# EAGLE design Backplane_extRefV4 (EAGLE 6.6.0)
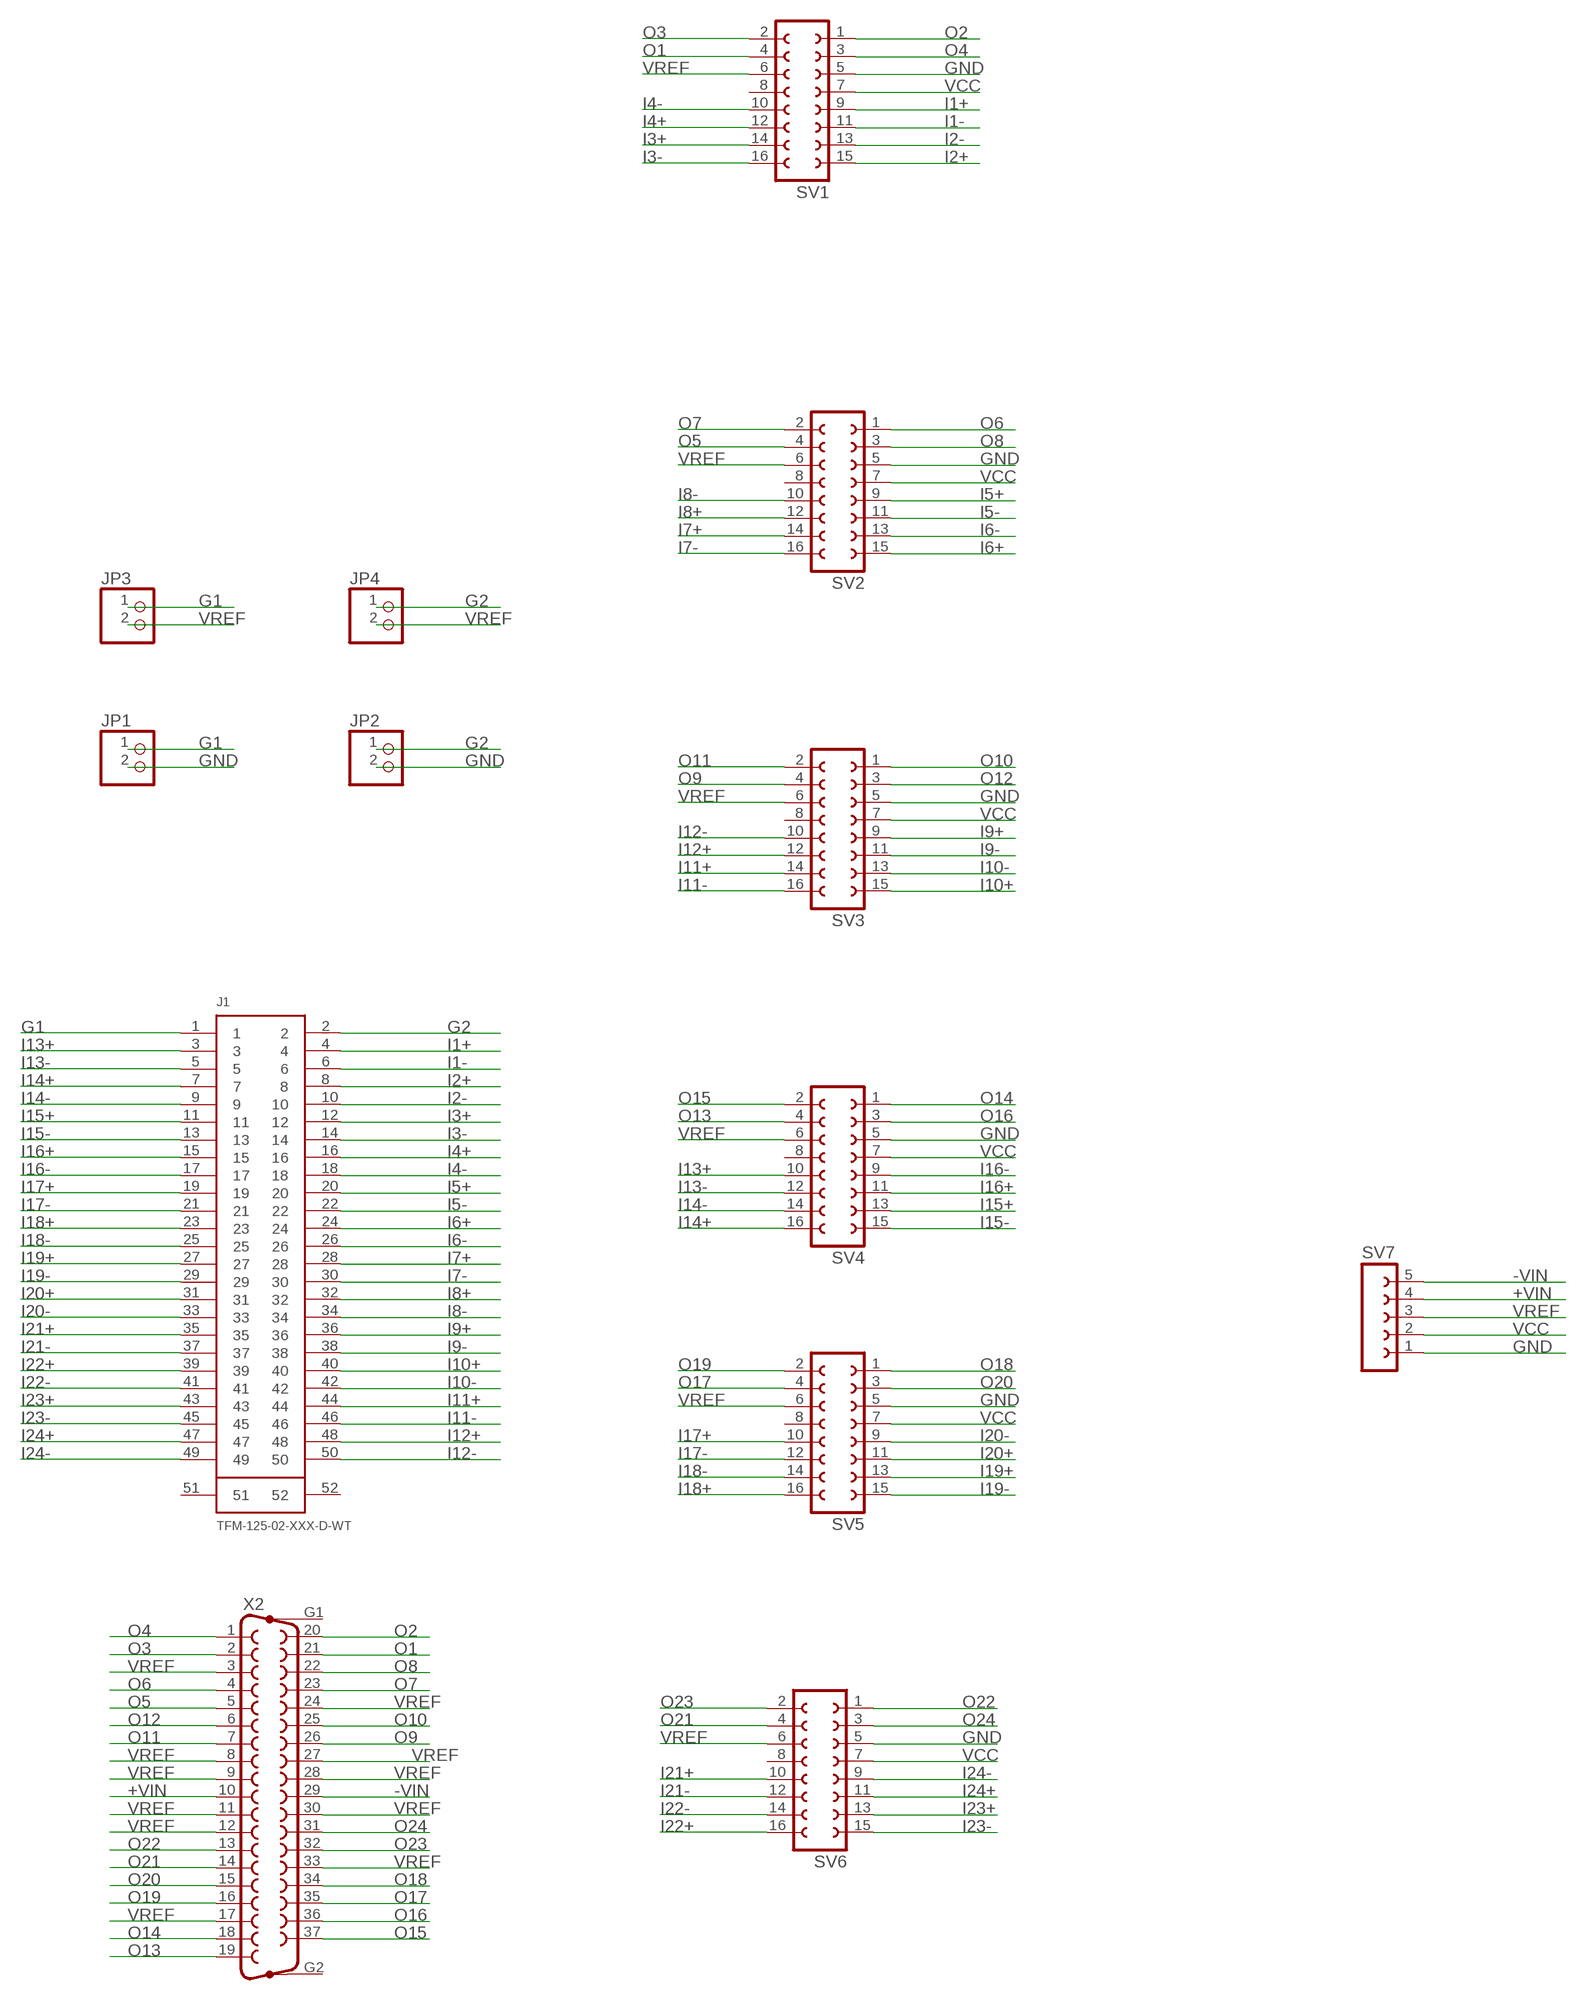
[diagram p0: schematic, sheet 1]

## Parts
J1  TFM-125-02-XXX-D-WT  [TFM-125-02-XXX-D-WT]
JP1  PINHD-1X2  [1X02]
JP2  PINHD-1X2  [1X02]
JP3  PINHD-1X2  [1X02]
JP4  PINHD-1X2  [1X02]
SV1  FE08-2  [FE08-2]
SV2  FE08-2  [FE08-2]
SV3  FE08-2  [FE08-2]
SV4  FE08-2  [FE08-2]
SV5  FE08-2  [FE08-2]
SV6  FE08-2  [FE08-2]
SV7  FE05-1  [FE05-1]
X2  F37HP  [F37HP]

## Nets
+VIN: SV7.4 X2.10
-VIN: SV7.5 X2.29
G1: J1.1 JP1.1 JP3.1
G2: J1.2 JP2.1 JP4.1
GND: JP1.2 JP2.2 SV1.5 SV2.5 SV3.5 SV4.5 SV5.5 SV6.5 SV7.1
I1+: J1.4 SV1.9
I1-: J1.6 SV1.11
I2+: J1.8 SV1.15
I2-: J1.10 SV1.13
I3+: J1.12 SV1.14
I3-: J1.14 SV1.16
I4+: J1.16 SV1.12
I4-: J1.18 SV1.10
I5+: J1.20 SV2.9
I5-: J1.22 SV2.11
I6+: J1.24 SV2.15
I6-: J1.26 SV2.13
I7+: J1.28 SV2.14
I7-: J1.30 SV2.16
I8+: J1.32 SV2.12
I8-: J1.34 SV2.10
I9+: J1.36 SV3.9
I9-: J1.38 SV3.11
I10+: J1.40 SV3.15
I10-: J1.42 SV3.13
I11+: J1.44 SV3.14
I11-: J1.46 SV3.16
I12+: J1.48 SV3.12
I12-: J1.50 SV3.10
I13+: J1.3 SV4.10
I13-: J1.5 SV4.12
I14+: J1.7 SV4.16
I14-: J1.9 SV4.14
I15+: J1.11 SV4.13
I15-: J1.13 SV4.15
I16+: J1.15 SV4.11
I16-: J1.17 SV4.9
I17+: J1.19 SV5.10
I17-: J1.21 SV5.12
I18+: J1.23 SV5.16
I18-: J1.25 SV5.14
I19+: J1.27 SV5.13
I19-: J1.29 SV5.15
I20+: J1.31 SV5.11
I20-: J1.33 SV5.9
I21+: J1.35 SV6.10
I21-: J1.37 SV6.12
I22+: J1.39 SV6.16
I22-: J1.41 SV6.14
I23+: J1.43 SV6.13
I23-: J1.45 SV6.15
I24+: J1.47 SV6.11
I24-: J1.49 SV6.9
O1: SV1.4 X2.21
O2: SV1.1 X2.20
O3: SV1.2 X2.2
O4: SV1.3 X2.1
O5: SV2.4 X2.5
O6: SV2.1 X2.4
O7: SV2.2 X2.23
O8: SV2.3 X2.22
O9: SV3.4 X2.26
O10: SV3.1 X2.25
O11: SV3.2 X2.7
O12: SV3.3 X2.6
O13: SV4.4 X2.19
O14: SV4.1 X2.18
O15: SV4.2 X2.37
O16: SV4.3 X2.36
O17: SV5.4 X2.35
O18: SV5.1 X2.34
O19: SV5.2 X2.16
O20: SV5.3 X2.15
O21: SV6.4 X2.14
O22: SV6.1 X2.13
O23: SV6.2 X2.32
O24: SV6.3 X2.31
VCC: SV1.7 SV2.7 SV3.7 SV4.7 SV5.7 SV6.7 SV7.2
VREF: JP3.2 JP4.2 SV1.6 SV2.6 SV3.6 SV4.6 SV5.6 SV6.6 SV7.3 X2.3 X2.8 X2.9 X2.11 X2.12 X2.17 X2.24 X2.27 X2.28 X2.30 X2.33
Unconnected: J1.51 J1.52 SV1.8 SV2.8 SV3.8 SV4.8 SV5.8 SV6.8 X2.G1 X2.G2

## Library data of the parts
J1 = TFM-125-02-XXX-D-WT:TFM-125-02-XXX-D-WT: 0.050"X0.050" SURFACE MOUNT TERMINAL STRIP WITH DUAL WELD TAB.
JP1-JP4 = pinhead:PINHD-1X2: PIN HEADER
SV1-SV6 = con-lsta:FE08-2: FEMALE HEADER; OC_FARNELL: unknown; OC_NEWARK: unknown
SV7 = con-lsta:FE05-1: FEMALE HEADER; OC_FARNELL: unknown; OC_NEWARK: unknown
X2 = con-subd:F37HP: SUB-D; OC_FARNELL: unknown; OC_NEWARK: unknown

## Board
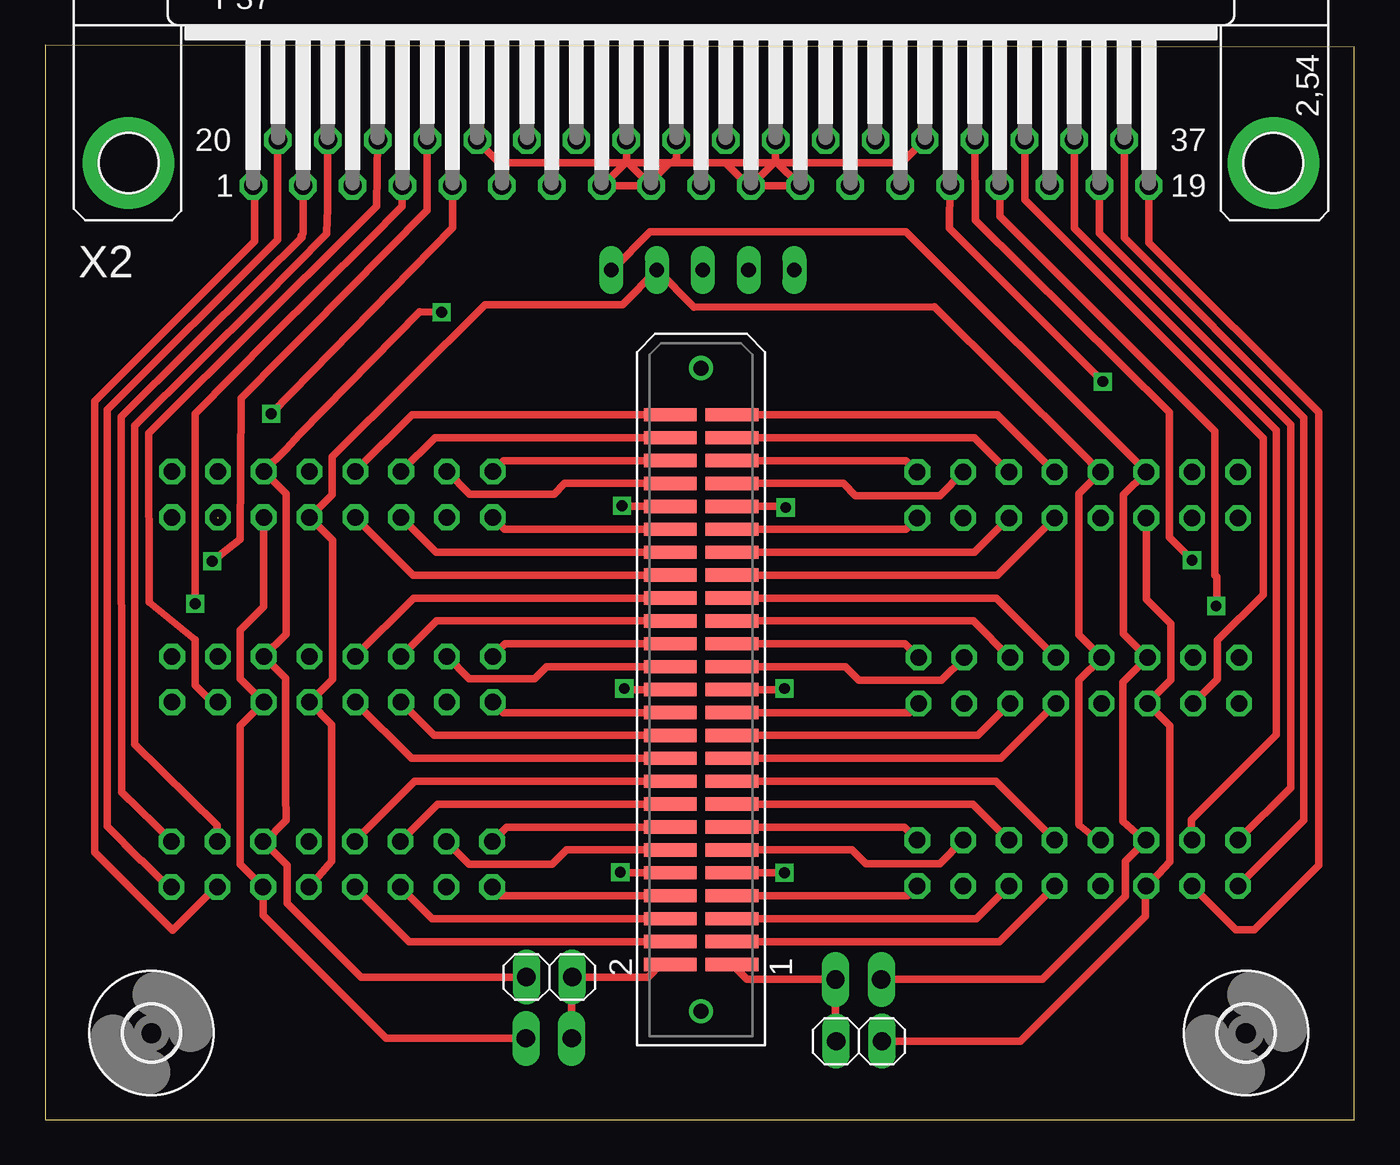
[diagram p1: board, top side]
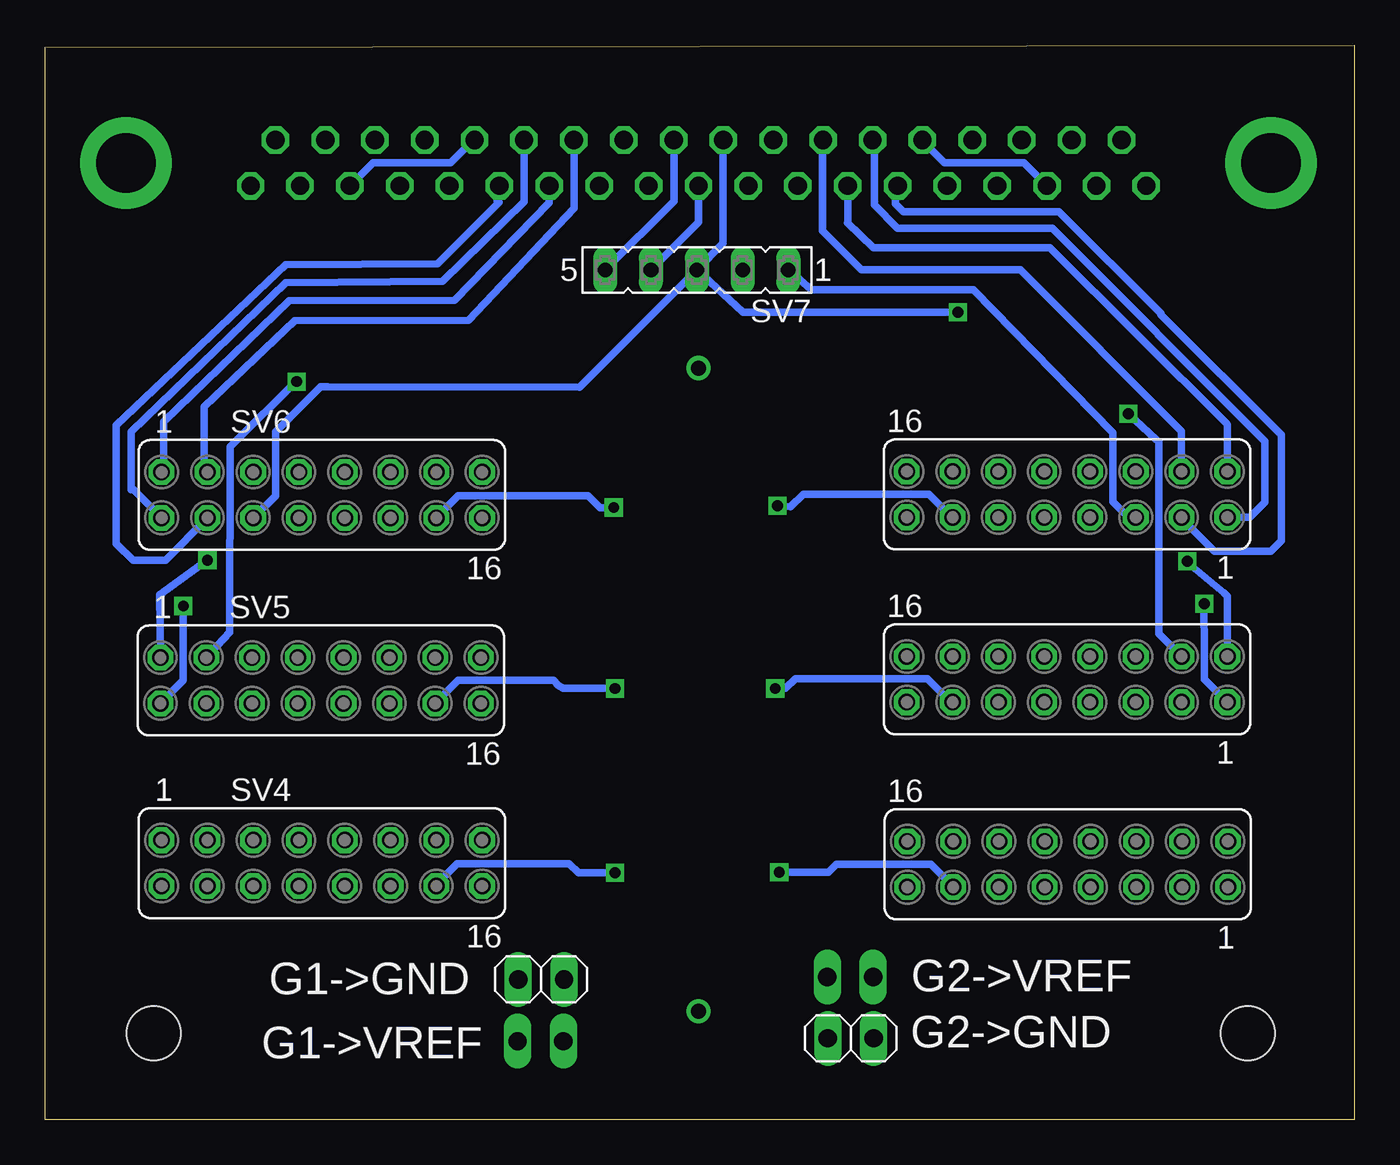
[diagram p2: board, bottom side, seen from below]

Size 72.63 x 59.58 mm. Coordinates in mm from the lower left corner, seen from the top.
Outline: 0,0 72.63,0 72.63,59.46 0,59.59 0,0
Copper layers (1*16): Top 0.035mm / dielectric 1.5mm / Bottom 0.035mm
Design rules "default *": minimum track width 10mil, minimum drill 10mil, track to track 8mil, track to pad 8mil, pad to pad 8mil, via to via 8mil, smd to smd 8mil, copper to edge 40mil, drill to drill 8mil, minimum pad ring 10mil, minimum via ring 8mil, stop-mask expansion 4mil, vias tented up to drill 0mil, thermal gap 10mil

### Footprints (pad centres in the part's own frame; a part is rotated, then mirrored left to right if it is on the bottom)
TFM-125-02-XXX-D-WT = smd 0.737 x 2.921: 1 -15.24,-1.714; 2 -15.24,1.714; 3 -13.97,-1.714; 4 -13.97,1.714; 5 -12.7,-1.714; 6 -12.7,1.714; 7 -11.43,-1.714; 8 -11.43,1.714; 9 -10.16,-1.714; 10 -10.16,1.714; 11 -8.89,-1.714; 12 -8.89,1.714; 13 -7.62,-1.714; 14 -7.62,1.714; 15 -6.35,-1.714; 16 -6.35,1.714; 17 -5.08,-1.714; 18 -5.08,1.714; 19 -3.81,-1.714; 20 -3.81,1.714; 21 -2.54,-1.714; 22 -2.54,1.714; 23 -1.27,-1.714; 24 -1.27,1.714; 25 0,-1.714; 26 0,1.714; 27 1.27,-1.714; 28 1.27,1.714; 29 2.54,-1.714; 30 2.54,1.714; 31 3.81,-1.714; 32 3.81,1.714; 33 5.08,-1.714; 34 5.08,1.714; 35 6.35,-1.714; 36 6.35,1.714; 37 7.62,-1.714; 38 7.62,1.714; 39 8.89,-1.714; 40 8.89,1.714; 41 10.16,-1.714; 42 10.16,1.714; 43 11.43,-1.714; 44 11.43,1.714; 45 12.7,-1.714; 46 12.7,1.714; 47 13.97,-1.714; 48 13.97,1.714; 49 15.24,-1.714; 50 15.24,1.714 | drill 0.838: 51 -17.831,0; 52 17.831,0
1X02 = drill 1.016 long: 1 -1.27,0; 2 1.27,0
FE08-2 = drill 0.914 octagon: 1 -8.89,1.27; 2 -8.89,-1.27; 3 -6.35,1.27; 4 -6.35,-1.27; 5 -3.81,1.27; 6 -3.81,-1.27; 7 -1.27,1.27; 8 -1.27,-1.27; 9 1.27,1.27; 10 1.27,-1.27; 11 3.81,1.27; 12 3.81,-1.27; 13 6.35,1.27; 14 6.35,-1.27; 15 8.89,1.27; 16 8.89,-1.27
FE05-1 = drill 0.813 long: 1 -5.08,0; 2 -2.54,0; 3 0,0; 4 2.54,0; 5 5.08,0
3,0 = hole 3: 0,0
F37HP = drill 1.016 octagon: 1 -24.841,-1.27; 2 -22.073,-1.27; 3 -19.329,-1.27; 4 -16.561,-1.27; 5 -13.792,-1.27; 6 -11.049,-1.27; 7 -8.28,-1.27; 8 -5.512,-1.27; 9 -2.769,-1.27; 10 0,-1.27; 11 2.769,-1.27; 12 5.512,-1.27; 13 8.28,-1.27; 14 11.049,-1.27; 15 13.818,-1.27; 16 16.561,-1.27; 17 19.329,-1.27; 18 22.098,-1.27; 19 24.841,-1.27; 20 -23.47,1.27; 21 -20.701,1.27; 22 -17.932,1.27; 23 -15.189,1.27; 24 -12.421,1.27; 25 -9.652,1.27; 26 -6.909,1.27; 27 -4.14,1.27; 28 -1.372,1.27; 29 1.372,1.27; 30 4.14,1.27; 31 6.909,1.27; 32 9.677,1.27; 33 12.421,1.27; 34 15.189,1.27; 35 17.958,1.27; 36 20.701,1.27; 37 23.47,1.27 | drill 3.302 pad 5.08: G1 -31.75,0; G2 31.75,0

### Placement (x,y rotation side)
J1  36.39,23.84 90 top
JP1  45.12,7.78 180 bottom
JP2  27.94,4.51 0 bottom
JP3  45.15,4.35 0 top
JP4  27.97,7.91 180 top
SV1  15.91,14.16 180 bottom
SV2  15.94,24.42 180 bottom
SV3  15.94,34.67 180 bottom
SV4  57.28,14.22 0 bottom
SV5  57.34,24.35 0 bottom
SV6  57.28,34.64 0 bottom
SV7  36.48,47.12 180 bottom
U$1  [3,0]  66.61,4.79 0 top
U$2  [3,0]  5.91,4.79 0 top
X2  36.39,53.05 0 top

### Tracks (layer width: path | path; a pad name or v marks a point on that pad's centre or on a via)
+VIN
  Bottom 0.406: SV7.4 36.39,49.75 X2.10
-VIN
  Bottom 0.406: X2.29 37.76,50.92 SV7.5
G1
  Top 0.406: JP3.1 43.85,4.38 JP1.1 38.93,7.78 J1.1
G2
  Top 0.406: JP2.1 29.21,7.87 JP4.1 33.43,7.91 34.16,8.64 34.64,8.64 J1.2
GND
  Top 0.406: SV3.5 12.13,28.45 10.83,27.15 10.83,24.45 SV2.5 10.83,21.84 10.83,14.16 SV1.5 12.1,11.34 18.92,4.51 JP2.2 | SV7.1 31.46,47.12 33.56,49.24 47.77,49.24 60.17,36.84 60.19,36.8 SV6.5 59.82,34.64 59.82,26.96 SV5.5 59.79,24.26 59.79,16.54 61.02,15.43 SV4.5 59.91,14.32 59.91,12.38 55.31,7.78 JP1.2
  Bottom 0.406: SV7.1 30.13,46.01 21.15,46.01 13.4,38.1 13.4,34.26 12.54,33.4 SV3.5
I1+
  Top 0.406: SV1.9 20.19,9.87 J1.4
I1-
  Top 0.406: SV1.11 21.46,11.14 J1.6
I2+
  Top 0.406: SV1.15 25.27,12.41 J1.8
I2-  (via drill 0.6)
  Top 0.406: J1.10 31.94,13.68 v31.91,13.72
  Bottom 0.406: v31.91,13.72 29.18,13.72 28.73,14.16 23.49,14.16 22.26,12.92 SV1.13
I3+
  Top 0.406: SV1.14 23.53,14.16 28.13,14.16 28.92,14.95 J1.12
I3-
  Top 0.406: SV1.16 25.59,16.22 J1.14
I4+
  Top 0.406: SV1.12 21.78,17.49 J1.16
I4-
  Top 0.406: SV1.10 20.51,18.76 J1.18
I5+
  Top 0.406: SV2.9 20.32,20.03 J1.20
I5-
  Top 0.406: SV2.11 21.59,21.3 J1.22
I6+
  Top 0.406: SV2.15 25.4,22.57 J1.24
I6-  (via drill 0.6)
  Top 0.406: J1.26 32.19,23.84 v32.13,23.91
  Bottom 0.406: v32.13,23.91 31.56,23.91 31.02,24.45 23.69,24.45 22.38,23.15 SV2.13
I7+
  Top 0.406: SV2.14 23.53,24.45 27.15,24.45 27.81,25.11 J1.28
I7-
  Top 0.406: SV2.16 25.53,26.38 J1.30
I8+
  Top 0.406: SV2.12 21.72,27.65 J1.32
I8-
  Top 0.406: SV2.10 20.45,28.92 J1.34
I9+
  Top 0.406: SV3.9 20.42,30.19 J1.36
I9-
  Top 0.406: SV3.11 21.69,31.46 J1.38
I10+
  Top 0.406: SV3.15 25.5,32.73 J1.40
I10-  (via drill 0.6)
  Top 0.406: J1.42 32.42,34 v32,34.04
  Bottom 0.406: v32,34.04 31.27,33.97 30.58,34.67 23.59,34.67 22.32,33.4 SV3.13
I11+
  Top 0.406: SV3.14 23.56,34.67 28.23,34.67 28.83,35.27 J1.44
I11-
  Top 0.406: SV3.16 25.43,36.54 J1.46
I12+
  Top 0.406: SV3.12 21.62,37.81 J1.48
I12-
  Top 0.406: SV3.10 20.35,39.08 J1.50
I13+
  Top 0.406: SV4.10 52.93,9.87 J1.3
I13-
  Top 0.406: SV4.12 51.66,11.14 J1.5
I14+
  Top 0.406: SV4.16 47.85,12.41 J1.7
I14-  (via drill 0.6)
  Top 0.406: J1.9 v41.02,13.68
  Bottom 0.406: v41.02,13.68 43.05,13.68 43.56,14.19 49.78,14.19 50.93,13.05 SV4.14
I15+
  Top 0.406: SV4.13 49.63,14.19 45.53,14.19 44.77,14.95 J1.11
I15-
  Top 0.406: SV4.15 47.66,16.22 J1.13
I16+
  Top 0.406: SV4.11 51.47,17.49 J1.15
I16-
  Top 0.406: SV4.9 52.74,18.76 J1.17
I17+
  Top 0.406: SV5.10 53.02,20.03 J1.19
I17-
  Top 0.406: SV5.12 51.75,21.3 J1.21
I18+
  Top 0.406: SV5.16 47.94,22.57 J1.23
I18-  (via drill 0.6)
  Top 0.406: J1.25 40.93,23.84 v41.02,23.91
  Bottom 0.406: v41.02,23.91 43.91,23.91 44.16,24.1 44.42,24.35 49.72,24.35 SV5.14
I19+
  Top 0.406: SV5.13 49.72,24.35 45.15,24.35 44.39,25.11 J1.27
I19-
  Top 0.406: SV5.15 47.69,26.38 J1.29
I20+
  Top 0.406: SV5.11 51.5,27.65 J1.31
I20-
  Top 0.406: SV5.9 52.77,28.92 J1.33
I21+
  Top 0.406: SV6.10 52.83,30.19 J1.35
I21-
  Top 0.406: SV6.12 51.56,31.46 J1.37
I22+
  Top 0.406: SV6.16 47.75,32.73 J1.39
I22-  (via drill 0.6)
  Top 0.406: J1.41 41.02,34 v41.08,33.94
  Bottom 0.406: v41.08,33.94 41.85,33.94 42.51,34.61 49.72,34.61 50.93,33.4 SV6.14
I23+
  Top 0.406: SV6.13 49.63,34.61 44.96,34.61 44.29,35.27 J1.43
I23-
  Top 0.406: SV6.15 47.75,36.54 J1.45
I24+
  Top 0.406: SV6.11 51.56,37.81 J1.47
I24-
  Top 0.406: SV6.9 52.83,39.08 J1.49
O1
  Top 0.406: SV1.4 9.56,16.32 4.98,20.83 4.98,38.48 12,45.47 15.62,49.12 15.62,49.21 15.68,50.51 X2.21
O2
  Top 0.406: X2.20 12.89,54.3 12.89,48.8 3.46,39.37 3.46,16.26 5.3,14.38 5.4,14.35 6.86,12.89 SV1.1
O3
  Top 0.406: SV1.2 7.05,15.43 4.25,18.16 4.22,38.99 11.94,46.64 14.26,48.93 14.19,49.02 14.31,49.14 X2.2
O4
  Top 0.406: X2.1 11.62,51.71 11.62,48.7 2.76,39.85 2.76,14.83 7.08,10.51 9.46,12.89 SV1.3
O5  (via drill 0.6)
  Top 0.406: v12.54,39.15 22.59,49.45 X2.5
  Bottom 0.406: v12.54,39.15 10.99,37.69 10.86,37.59 10.86,26.96 SV2.4
O6  (via drill 0.6)
  Top 0.406: v8.32,28.61 8.32,39.15 12.54,43.4 17.91,48.74 19.81,50.64 19.81,51.77 X2.4
  Bottom 0.406: v8.32,28.61 8.35,27.88 8.32,26.61 8.32,24.42 SV2.1
O7  (via drill 0.6)
  Top 0.406: v9.27,30.96 10.83,32.19 10.89,40.01 13.24,42.39 14.51,43.66 21.18,50.41 21.2,50.42 X2.23
  Bottom 0.406: SV2.2 7.05,29.02 7.24,29.21 9.18,30.83 9.24,30.89 v9.27,30.96
O8
  Top 0.406: X2.22 18.38,50.64 16.89,49.15 12.1,44.39 5.75,38.07 5.78,28.7 8.32,26.61 8.32,24.1 9.27,23.15 SV2.3
O9
  Bottom 0.406: SV3.4 9.59,38.16 18.54,47.12 27.34,47.12 29.5,49.28 29.5,54.3 X2.26
O10
  Bottom 0.406: X2.25 26.64,54.23 26.64,50.74 25.34,49.44 16.76,49.44 11.11,43.78 10.79,43.43 4.98,37.62 4.98,34.23 5.81,33.4 SV3.1
O11
  Bottom 0.406: SV3.2 7.05,38.54 7.08,38.58 16.89,48.35 26.67,48.35 28.13,49.72 28.11,49.75 X2.7
O12  (1 unrouted)
  Top 0.406: 25.27,51.72 X2.6
  Bottom 0.406: 25.37,51.75 X2.6 25.46,51.66 25.46,50.8 25.02,50.35 16.38,50.35 10.73,44.7 10.73,44.64 4.06,37.97 4.06,32.1 4.64,31.53 7.78,31.53 9.59,33.34
O13
  Top 0.406: X2.19 61.23,48.63 70.64,39.21 70.64,14.1 67.09,10.54 66.04,10.54 SV4.4
O14
  Top 0.406: X2.18 58.48,49.15 69.09,38.54 69.09,18.41 SV4.1
O15
  Top 0.406: X2.37 59.86,48.89 69.82,38.92 69.82,16.61 SV4.2
O16
  Top 0.406: X2.36 57.09,49.44 68.29,38.23 68.29,21.34 63.6,16.64 63.6,15.53 SV4.3
O17
  Top 0.406: X2.35 54.34,51 67.56,37.78 67.56,29.11 65.02,26.57 65.02,24.42 SV5.4
O18  (via drill 0.6)
  Top 0.406: X2.34 51.61,49.87 62.36,39.21 62.36,32.29 v63.63,31.02
  Bottom 0.406: SV5.1 66.26,29.11 v63.63,31.02
O19  (via drill 0.6)
  Top 0.406: v64.96,28.48 64.99,28.51 64.99,30.1 64.9,30.19 64.9,38.16 52.96,50.1 52.96,51.77 X2.16
  Bottom 0.406: SV5.2 64.96,24.35 v64.96,28.48
O20  (via drill 0.6)
  Top 0.406: v58.67,40.93 50.17,49.43 X2.15
  Bottom 0.406: SV5.3 62.39,27.02 62.36,37.31 58.58,41.08 v58.67,40.93
O21
  Bottom 0.406: SV6.4 63.63,33.34 65.94,31.02 67.75,31.02 68.68,31.94 68.68,38.51 59.28,47.4 50.86,47.47 47.43,50.86 47.53,50.96 47.56,50.96 47.43,51.09 X2.14
O22
  Bottom 0.406: SV6.1 66.04,36.04 66.04,38.7 59.09,45.4 49.91,45.43 44.67,50.83 44.67,50.84 X2.13
O23
  Bottom 0.406: SV6.2 67.72,34.92 67.85,34.92 67.85,38.13 59.28,46.42 50.58,46.48 46.06,50.9 X2.32
O24
  Bottom 0.406: SV6.3 63.81,36.09 63.81,39.52 58.8,44.29 49.15,44.32 43.28,50.55 43.29,50.56 X2.31
VCC
  Top 0.406: SV1.7 15.91,14.32 15.91,21.91 SV2.7 15.94,24.42 15.94,32.13 SV3.7 15.92,34.66 15.92,36.75 24.42,45.18 32.04,45.18 SV7.2 36,45.05 49.34,45.09 57.37,37.08 SV6.7 57.34,34.7 57.34,26.89 SV5.7 57.34,24.35 57.34,16.38 57.37,16.32 58.48,15.43 SV4.7
VREF  (via drill 0.6)
  Top 0.406: SV5.6 61.18,23.11 | v22,44.77 20.76,44.8 14.13,38.01 13.37,37.18 SV3.6 13.37,34.7 13.37,26.92 SV2.6 13.34,24.48 13.34,18.13 13.36,16.6 12.16,15.37 SV1.6 13.43,14.1 13.43,12 17.53,7.91 JP4.2 | SV6.6 61.09,28.86 62.45,27.5 62.45,24.38 SV5.6 | X2.33 47.54,53.05 37.75,53.05 | 37.75,53.05 34.8,53.05 | 34.8,53.05 34.64,53.05 | 34.64,53.05 25.18,53.05 23.96,54.27 X2.24 | X2.8 X2.9 | X2.9 32.25,53.16 X2.27 32.25,53.1 30.67,51.53 | X2.30 40.53,53.16 | 40.53,53.16 X2.12 | X2.28 35.01,53.27 34.8,53.05 | 40.53,53.16 X2.11 | X2.9 33.62,52.03 34.64,53.05 | X2.11 39.02,51.78 37.75,53.05 | X2.11 41.85,51.78 41.91,51.72 41.85,51.72 41.81,51.75 | JP3.2 54.1,4.35 61.02,11.27 61.02,12.89 SV4.6 61.12,12.92 62.39,14.29 62.39,21.84 SV5.6
  Bottom 0.406: SV7.3 35.01,48.58 X2.28 | SV7.3 42.99,40.61 56.96,40.63 57.35,40.63 59.85,38.13 59.85,34.61 SV6.6 | v22,44.77 33.91,44.77 SV7.3 | X2.3 18.33,53.05 22.73,53.05 23.96,54.29 X2.24 | X2.17 54.44,53.05 50.13,53.05 48.86,54.32 X2.33

### Text on the board
bNames: G2->VREF | G1->GND | G2->GND | G1->VREF